# Altium schematic sheet AMS_Master.SchDoc
size A4; DocumentNumber: 0; SheetNumber: 1; SheetTotal: 10
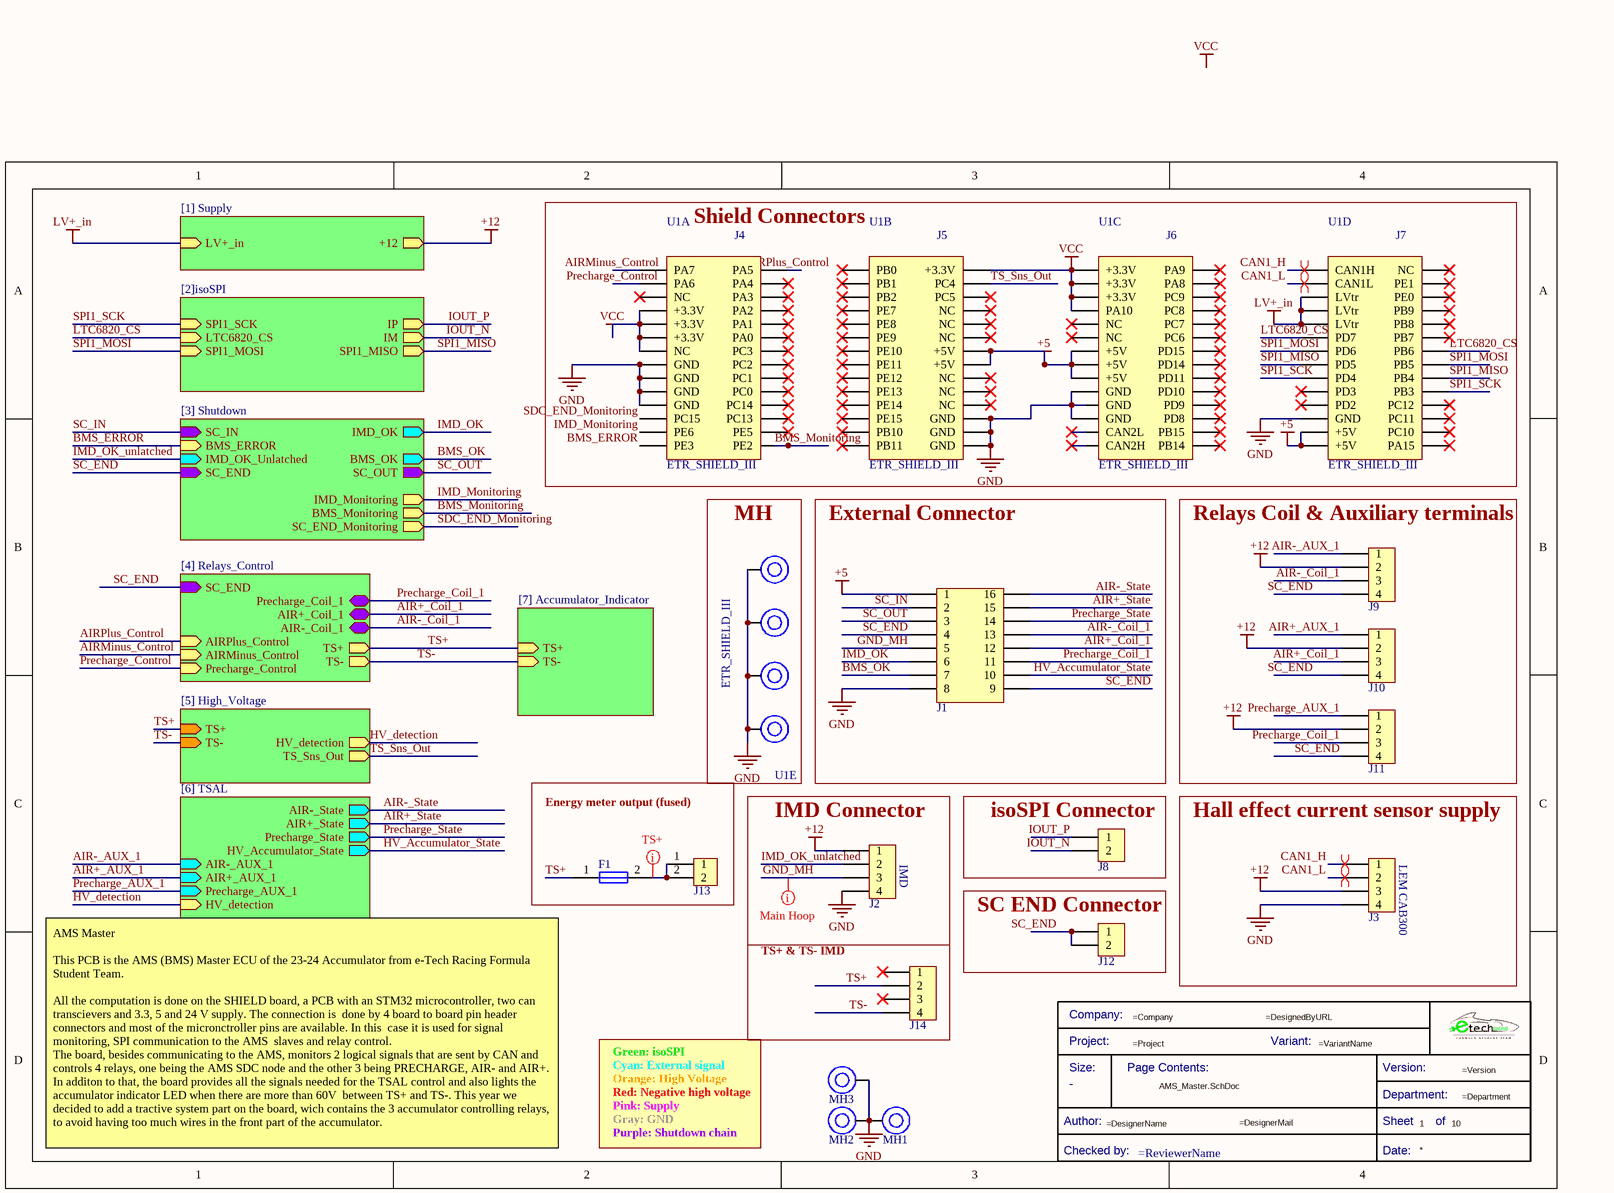
[diagram p0: AMS_Master.SchDoc]

## Parts
(Parts that share a designator on the sheet are numbered #1, #2 ... from top to bottom, then left to right.)
*?  Title Block_template  (value not drawn)  (graphical)
F1  FUSE_2.5A_1000V  [FUSE_2.5A_1000V]  (value not drawn)
J1  1053101116  [J_NanoFit_2x8_V]  (value not drawn)
J2  1053091204  [J_NanoFit_1x4_V]  (value not drawn)
J3  1053091204  [J_NanoFit_1x4_V]  (value not drawn)
J8  105309-2202  [J_NanoFit_1x2_V]  (value not drawn)
J9  1053091204  [J_NanoFit_1x4_V - duplicate]  (value not drawn)
J10  1053091204  [J_NanoFit_1x4_V - duplicate]  (value not drawn)
J11  1053091204  [J_NanoFit_1x4_V - duplicate]  (value not drawn)
J12  105309-2202  [J_NanoFit_1x2_V]  (value not drawn)
J13  436500215  [J_MicroFit_2x1]  (value not drawn)
J14  436500415  [J_MicroFit_1X4_V]  (value not drawn)
MH1  Mounting_Hole_M4  [Mounting_Hole_M4]  (value not drawn)
MH2  Mounting_Hole_M4  [Mounting_Hole_M4]  (value not drawn)
MH3  Mounting_Hole_M4  [Mounting_Hole_M4]  (value not drawn)
U1#1  ETR_SHIELD_III  [ETR_SHIELD_III]  (parts A,B,C,D of 4)
U1#2  ETR_SHIELD_III  [ETR_SHIELD_III]  (part E of 5)

## Blocks framed on the sheet
Shield Connectors: U1#1
MH: U1#2
External Connector: J1
Relays Coil & Auxiliary terminals: J9-J11
Energy meter output (fused): F1 J13
IMD Connector: J2
isoSPI Connector: J8
Hall effect current sensor supply: J3
SC END Connector: J12
TS+ & TS- IMD: J14

## Sub-sheets
Designator = [7] Accumulator_Indicator: TS+ (in), TS- (in)
High_Voltage = [5] High_Voltage: HV_detection (out), TS- (in), TS+ (in), TS_Sns_Out (out)
isoSPI = [2]isoSPI: SPI1_SCK (in), LTC6820_CS (in), SPI1_MOSI (in), SPI1_MISO (out), IP (out), IM (out)
Relays_Control = [4] Relays_Control: Precharge_Coil_1 (bidir), AIR+_Coil_1 (bidir), AIR-_Coil_1 (bidir), AIRPlus_Control (in), AIRMinus_Control (in), Precharge_Control (in), SC_END (in), TS+ (out), TS- (out)
Shutdown = [3] Shutdown: BMS_ERROR (in), SC_IN (in), BMS_OK (out), IMD_OK (out), IMD_OK_Unlatched (in), BMS_Monitoring (out), IMD_Monitoring (out), SC_OUT (out), SC_END (in), SC_END_Monitoring (out)
Supply = [1] Supply: LV+_in (in), +12 (out)
TSAL = [6] TSAL: Precharge_State (out), AIR-_State (out), AIR+_State (out), HV_Accumulator_State (out), HV_detection (in), AIR-_AUX_1 (in), AIR+_AUX_1 (in), Precharge_AUX_1 (in)

## Nets
+5: J1.1 U1#1.5V_1(+5V) U1#1.5V_2(+5V) U1#1.5V_3(+5V) U1#1.5V_4(+5V) U1#1.5V_5(+5V) U1#1.5V_6(+5V) U1#1.5V_7(+5V)
+12: J2.1 J3.3 J9.2 J10.2 J11.2 ; sheet Supply/+12
GND: J1.8 J2.4 J3.4 MH1.1 MH2.1 MH3.1 U1#1.GND_1(GND) U1#1.GND_2(GND) U1#1.GND_3(GND) U1#1.GND_4(GND) U1#1.GND_5(GND) U1#1.GND_6(GND) U1#1.GND_7(GND) U1#1.GND_8(GND) U1#1.GND_9(GND) U1#1.GND_10(GND) U1#1.GND_11(GND) U1#2.1(Mounting_HoleM4) U1#2.2(Mounting_HoleM4) U1#2.3(Mounting_HoleM4) U1#2.4(Mounting_HoleM4)
LV+_in: U1#1.LVtr_2(LVtr) U1#1.LVtr_3(LVtr) U1#1.LVtr_4(LVtr) ; sheet Supply/LV+_in
VCC: U1#1.3V3_1(+3.3V) U1#1.3V3_2(+3.3V) U1#1.3V3_3(+3.3V) U1#1.3V3_4(+3.3V) U1#1.3V3_5(+3.3V) U1#1.3V3_6(+3.3V) U1#1.3V3_7(+3.3V) U1#1.NC_2(NC) U1#1.PA10
AIR+_AUX_1: J10.1 ; sheet TSAL/AIR+_AUX_1
AIR+_Coil_1: J1.12 J10.3 ; sheet Relays_Control/AIR+_Coil_1
AIR+_State: J1.15 ; sheet TSAL/AIR+_State
AIR-_AUX_1: J9.1 ; sheet TSAL/AIR-_AUX_1
AIR-_Coil_1: J1.13 J9.3 ; sheet Relays_Control/AIR-_Coil_1
AIR-_State: J1.16 ; sheet TSAL/AIR-_State
AIRMinus_Control: U1#1.PA7 ; sheet Relays_Control/AIRMinus_Control
AIRPlus_Control: U1#1.PA5 ; sheet Relays_Control/AIRPlus_Control
BMS_ERROR: U1#1.PE3 ; sheet Shutdown/BMS_ERROR
BMS_Monitoring: U1#1.PE2 ; sheet Shutdown/BMS_Monitoring
BMS_OK: J1.7 ; sheet Shutdown/BMS_OK
CAN1_H: J3.1 U1#1.CAN1H
CAN1_L: J3.2 U1#1.CAN1L
GND_MH: J1.5 J2.3
HV_Accumulator_State: J1.10 ; sheet TSAL/HV_Accumulator_State
HV_detection: sheet High_Voltage/HV_detection, sheet TSAL/HV_detection
IMD_Monitoring: U1#1.PE6 ; sheet Shutdown/IMD_Monitoring
IMD_OK: J1.6 ; sheet Shutdown/IMD_OK
IMD_OK_unlatched: J2.2 ; sheet Shutdown/IMD_OK_Unlatched
IOUT_N: J8.2 ; sheet isoSPI/IM
IOUT_P: J8.1 ; sheet isoSPI/IP
LTC6820_CS: U1#1.PB6 U1#1.PD7 ; sheet isoSPI/LTC6820_CS
Precharge_AUX_1: J11.1 ; sheet TSAL/Precharge_AUX_1
Precharge_Coil_1: J1.11 J11.3 ; sheet Relays_Control/Precharge_Coil_1
Precharge_Control: U1#1.PA6 ; sheet Relays_Control/Precharge_Control
Precharge_State: J1.14 ; sheet TSAL/Precharge_State
SC_END: J1.4 J1.9 J9.4 J10.4 J11.4 J12.1 J12.2 ; sheet Shutdown/SC_END, sheet Relays_Control/SC_END
SC_IN: J1.2 ; sheet Shutdown/SC_IN
SC_OUT: J1.3 ; sheet Shutdown/SC_OUT
SDC_END_Monitoring: U1#1.PC15 ; sheet Shutdown/SC_END_Monitoring
SPI1_MISO: U1#1.PB4 U1#1.PD5 ; sheet isoSPI/SPI1_MISO
SPI1_MOSI: U1#1.PB5 U1#1.PD6 ; sheet isoSPI/SPI1_MOSI
SPI1_SCK: U1#1.PB3 U1#1.PD4 ; sheet isoSPI/SPI1_SCK
TS+: F1.1 J14.2 ; sheet High_Voltage/TS+, sheet Relays_Control/TS+, sheet Designator/TS+
TS-: J14.4 ; sheet High_Voltage/TS-, sheet Relays_Control/TS-, sheet Designator/TS-
TS_Sns_Out: U1#1.PC4 ; sheet High_Voltage/TS_Sns_Out
NetF1_2: F1.2 J13.1 J13.2

Not connected (* = marked no-connect by the designer): J14 1* 3*; U1#1 CAN2H* CAN2L* NC_1(NC)* NC_3(NC)* NC_4(NC)* NC_5(NC)* NC_6(NC)* NC_7(NC)* NC_8(NC)* NC_9(NC)* NC_10(NC)* NC_13(NC)* PA0* PA1* PA2* PA3* PA4* PA8* PA9* PA15* PB0* PB1* PB2* PB7* PB8* PB9* PB10* PB11* PB14* PB15* PC0* PC1* PC2* PC3* PC5* PC6* PC7* PC8* PC9* PC10* PC11* PC12* PC13* PC14* PD2* PD3* PD8* PD9* PD10* PD11* PD14* PD15* PE0* PE1* PE5* PE7* PE8* PE9* PE10* PE11* PE12* PE13* PE14* PE15*

## Layout directives
mark named Main Hoop: GND_MH
differential pair: CAN1_H, CAN1_L
net class TS+: NetF1_2

## Notes on the sheet
- (near J2) IMD
- (near J3) LEM CAB300
- Cyan: External signal
- Orange: High Voltage
- Green: isoSPI
- AMS Master
  This PCB is the AMS (BMS) Master ECU of the 23-24 Accumulator from e-Tech Racing Formula Student Team.
  All the computation is done on the SHIELD board, a PCB with an STM32 microcontroller, two can transcievers and 3.3, 5 and 24 V supply. The connection is  done by 4 board to board pin header connectors and most of the micronctroller pins are available. In this  case it is used for signal monitoring, SPI communication to the AMS  slaves and relay control.
  The board, besides communicating to the AMS, monitors 2 logical signals that are sent by CAN and controls 4 relays, one being the AMS SDC node and the other 3 being PRECHARGE, AIR- and AIR+.
  In additon to that, the board provides all the signals needed for the TSAL control and also lights the accumulator indicator LED when there are more than 60V  between TS+ and TS-. This year we decided to add a tractive system part on the board, wich contains the 3 accumulator controlling relays, to avoid having too much wires in the front part of the accumulator.
- Red: Negative high voltage
- Gray: GND
- Pink: Supply
- Purple: Shutdown chain
- Labels drawn without touching a wire or pin: VCC
- Title
- Size:
- Date:
- A4
- Number:
- Time:
- Revision:
- Sheet
- of
- File:
- (in symbol ETR_Shield_III, part A) J4
- (in symbol ETR_Shield_III, part B) J5
- (in symbol ETR_Shield_III, part C) J6
- (in symbol ETR_Shield_III, part D) J7
- (in symbol Title Block_template) Company:; Project:; Variant:; Size:; Page Contents:; Version:; Department:; Author:; Sheet; of; Checked by:; Date:

## Library data of the parts
*? = Title Block_template: Standard Title Block; Category: Title Block; Checked by:: =ReviewerName; Size: -
J1 = J_NanoFit_2x8_V: Nano-Fit Vertical Header Through Hole 2.50mm Pitch Dual Row 16 Circuits with Kinked Pins Tin (Sn) Plating Black; Manufacturer 1: Molex; Manufacturer Part Number 1: 105310-1116; Connector Type: Header,Male Pin; Number of Positions: 16; .Creator: AC; Supplier 1: Digi-Key; RoHS: No; Category: Headers and Wire Housings; Stock 1: 84; Pricing 1: 1=3,21000, 10=2,82400, 84=2,24619, 1008=1,86110, 4956=1,66858 (USD); Mount: Through Hole; Contact Plating: Tin; Contact Material: Brass; Contact Shape: Square; Insulation Material: Polymer; Insulation Color: Black; Min Operating Temperature: -40°C; Max Operating Temperature: 105°C; Fastening Type: Latch; Packaging: Tray; Number of Rows: 2; Termination: Kinked Pin; ComponentLink1URL: https://www.molex.com/pdm_docs/sd/1053101210_sd.pdf?src-supplier=Digi-Key; ComponentLink1Description: https://www.molex.com/pdm_docs/sd/1053101210_sd.pdf?src-supplier=Digi-Key; Supplier Part Number 1: WM16885-ND; ComponentLink2Description: Molex; ComponentLink2URL: https://www.molex.com/molex/products/part-detail/pcb_headers/1053101116
J2 J3 J9-J11 = J_NanoFit_1x4_V: Nano-Fit Vertical Header Through Hole 2.50mm Pitch Single Row 4 Circuits with Kinked Pins 0.38; Manufacturer 1: Molex; Manufacturer Part Number 1: 105309-1204; .Creator: DO; Supplier 1: Arrow Electronics; RoHS: No; Category: Headers and Wire Housings; Stock 1: 709; Pricing 1: 1=1,37050, 10=1,11700, 100=0,95270, 500=0,86980, 1000=0,74060, 2500=0,71930, 5000=0,68450, 10000=0,66860 (USD); ComponentLink1URL: http://farnell.com//datasheets/2221349.pdf?src-supplier=Farnell; ComponentLink1Description: http://farnell.com//datasheets/2221349.pdf?src-supplier=Farnell; ComponentLink2URL: http://www.farnell.com/datasheets/2221349.pdf?src-supplier=Newark; ComponentLink2Description: http://www.farnell.com/datasheets/2221349.pdf?src-supplier=Newark; ComponentLink3URL: http://www.literature.molex.com/SQLImages/kelmscott/Molex/PDF_Images/987651-1223.PDF?src-supplier=Digi-Key; ComponentLink3Description: http://www.literature.molex.com/SQLImages/kelmscott/Molex/PDF_Images/987651-1223.PDF?src-supplier=Digi-Key; ComponentLink4URL: http://www.farnell.com/datasheets/2059602.pdf?src-supplier=Element14; ComponentLink4Description: http://www.farnell.com/datasheets/2059602.pdf?src-supplier=Element14; Supplier Part Number 1: 105309-1204
J8 J12 = J_Nanofit_1x2_V: Nano-Fit Vertical Header, Through Hole, 2.50mm Pitch, Single Row, 2 Circuits, with Kinked Pins, Tin (Sn) Plating,...; Manufacturer: Molex; Supplier 1: Mouser; Manufacturer Part Number: 105309-2202; RoHS: Yes; Category: Uncategorized; Stock 1: 6319; Pricing 1: 1=1,1, 10=0,888, 50=0,888, 100=0,735, 1000=0,59, 10000=0,515 (USD); ComponentLink1URL: https://www.molex.com/pdm_docs/sd/1053092202_sd.pdf?src-supplier=Digi-Key; ComponentLink1Description: https://www.molex.com/pdm_docs/sd/1053092202_sd.pdf?src-supplier=Digi-Key; Supplier Part Number 1: 538-105309-2202
J13 = J_MicroFit_2x1: Header 1 Row Vertical Polarizing Peg 2 Pin SMT/Glow Wire Compatible Tin Plate; Manufacturer 1: Molex; Manufacturer Part Number 1: 43650-0215; Supplier 1: Arrow Electronics; RoHS: Yes; Category: Headers and Wire Housings; Stock 1: 11086; Pricing 1: 1=0,87800, 10=0,74400, 80=0,63070, 3264=0,47000, 6528=0,45100, 13056=0,41760 (USD); ComponentLink1URL: https://datasheet.ciiva.com/19462/884109-19462034.pdf?src-supplier=Jameco; ComponentLink1Description: https://datasheet.ciiva.com/19462/884109-19462034.pdf?src-supplier=Jameco; ComponentLink2URL: https://datasheet.ciiva.com/5157/0436500215-pcb-headers-148687-5157608.pdf?src-supplier=Mouser; ComponentLink2Description: https://datasheet.ciiva.com/5157/0436500215-pcb-headers-148687-5157608.pdf?src-supplier=Mouser; ComponentLink3URL: https://datasheet.ciiva.com/16085/0436500215-pcb-headers-16085668.pdf?src-supplier=Onlinecomponents.com; ComponentLink3Description: https://datasheet.ciiva.com/16085/0436500215-pcb-headers-16085668.pdf?src-supplier=Onlinecomponents.com; ComponentLink4URL: https://datasheet.ciiva.com/11748/0900766b80307ce2-11748388.pdf?src-supplier=RSComponents; ComponentLink4Description: https://datasheet.ciiva.com/11748/0900766b80307ce2-11748388.pdf?src-supplier=RSComponents; ComponentLink5URL: https://datasheet.ciiva.com/9432/0436500215-pcb-headers-9432850.pdf?src-supplier=Avnet; ComponentLink5Description: https://datasheet.ciiva.com/9432/0436500215-pcb-headers-9432850.pdf?src-supplier=Avnet; ComponentLink6URL: https://datasheet.ciiva.com/7920/1889390-7920892.pdf?src-supplier=Element14; ComponentLink6Description: https://datasheet.ciiva.com/7920/1889390-7920892.pdf?src-supplier=Element14; Supplier Part Number 1: 43650-0215
J14 = J_Microfit_1x4_V